# EAGLE schematic wateralarm (EAGLE 9.5.0)
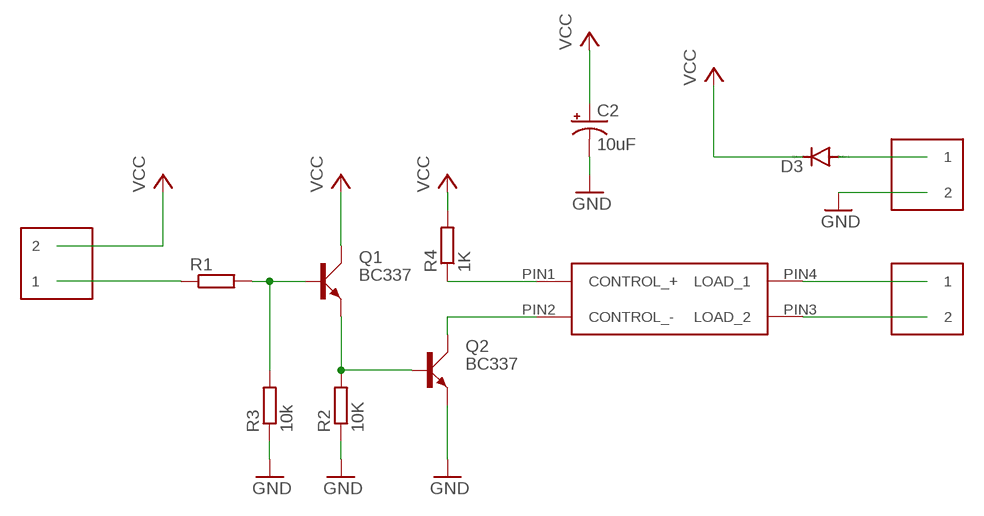
[diagram p0: schematic, sheet 1]

## Parts
C2  10uF  10UF-POLAR-RADIAL-2.5MM-25V-20%  [CPOL-RADIAL-2.5MM-5MM]
D3  DIODE-DO214AC  [DO214AC]
Q1  BC337  [SOT54A]
Q2  BC337  [SOT54A]
R1  R-EU_R0805  [R0805]
R2  10K  R-EU_R0805  [R0805]
R3  10k  R-EU_R0805  [R0805]
R4  1K  R-EU_R0805  [R0805]
U$1  OPTO-RELAY-CPC1017N  [SOP-4]
U$2  KF350-P2  [KF350-2P]
U$3  KF350-P2  [KF350-2P]
U$4  KF350-P2  [KF350-2P]

## Nets
GND: C2.2(-) Q2.E R2.1 R3.1 U$3.2
N$1: Q1.B R1.2 R3.2
N$2: Q1.E Q2.B R2.2
N$3: Q2.C U$1.PIN2(CONTROL_-)
N$4: R4.1 U$1.PIN1(CONTROL_+)
N$5: R1.1 U$4.1
N$6: U$1.PIN4(LOAD_1) U$2.1
N$7: U$1.PIN3(LOAD_2) U$2.2
N$8: D3.A U$3.1
VCC: C2.1(+) D3.C Q1.C R4.2 U$4.2

## Library data of the parts
C2 = SparkFun-Capacitors:10UF-POLAR: 10.0µF polarized capacitors A capacitor is a passive two-terminal electrical component used to store electrical energy temporarily in an electric field.; PROD_ID: CAP-08440
D3 = diode:DIODE-: DIODE
Q1 Q2 = transistor-small-signal:BC337: NPN TRANSISTOR
R1-R4 = resistor:R-EU_: RESISTOR, European symbol
U$1 = Feesta-partsu:OPTO-RELAY-CPC1017N
U$2-U$4 = KF350-P2:KF350-P2